# Altium schematic sheet board_pa98.SchDoc
size 840 x 594 mm; Scale: 1:1
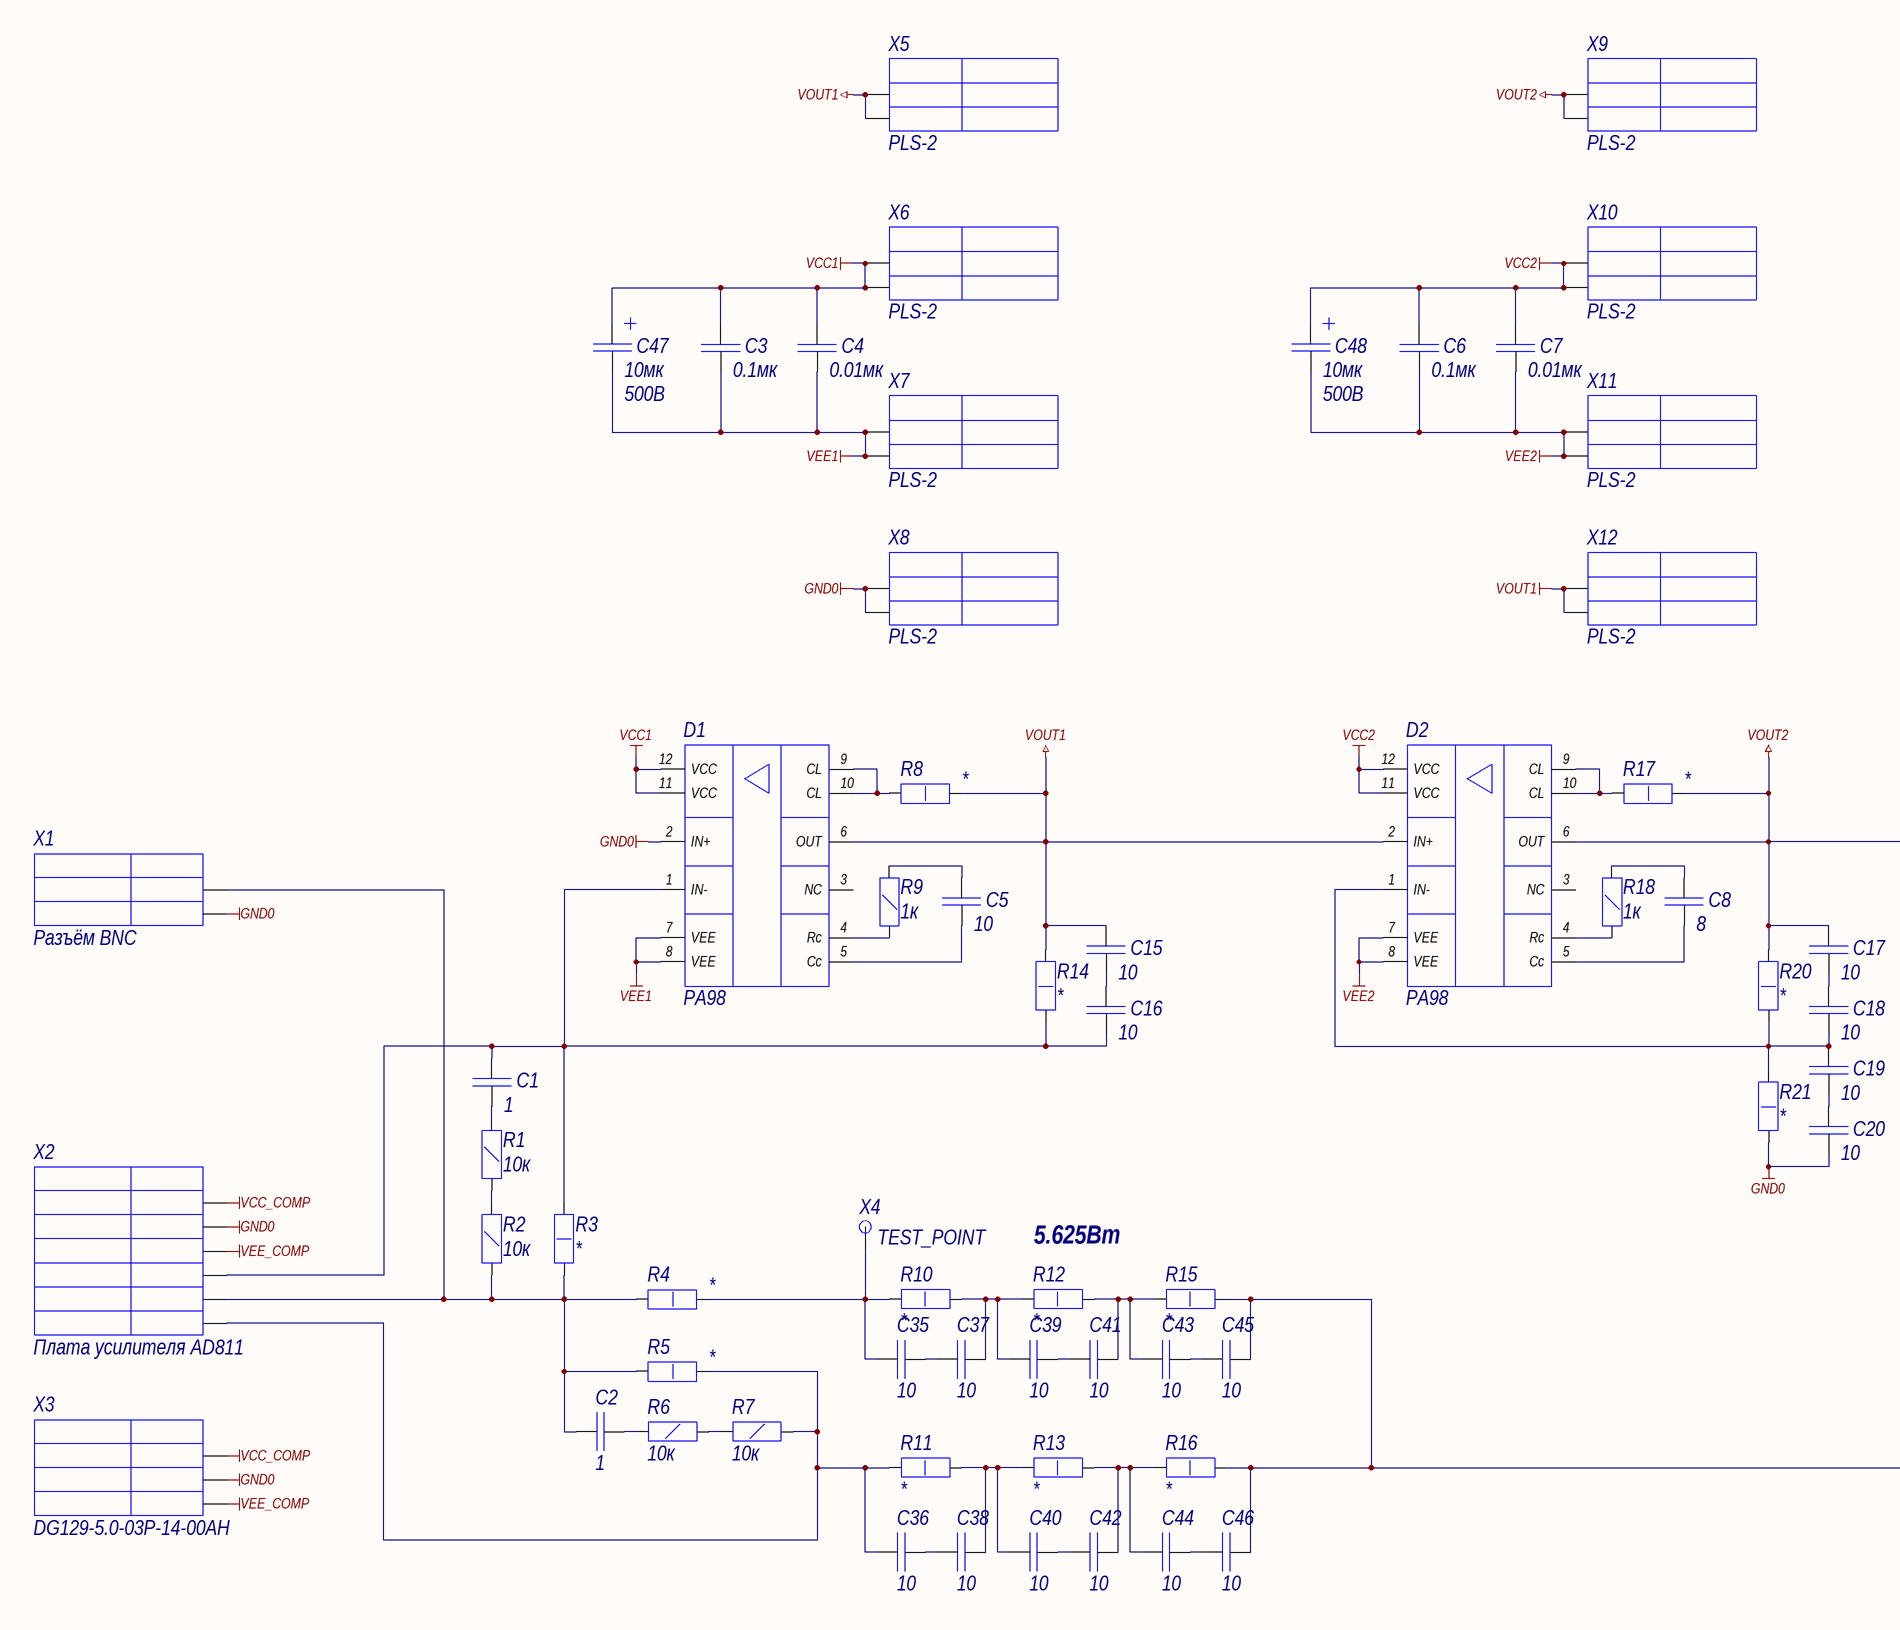
[diagram p0: board_pa98.SchDoc, left]
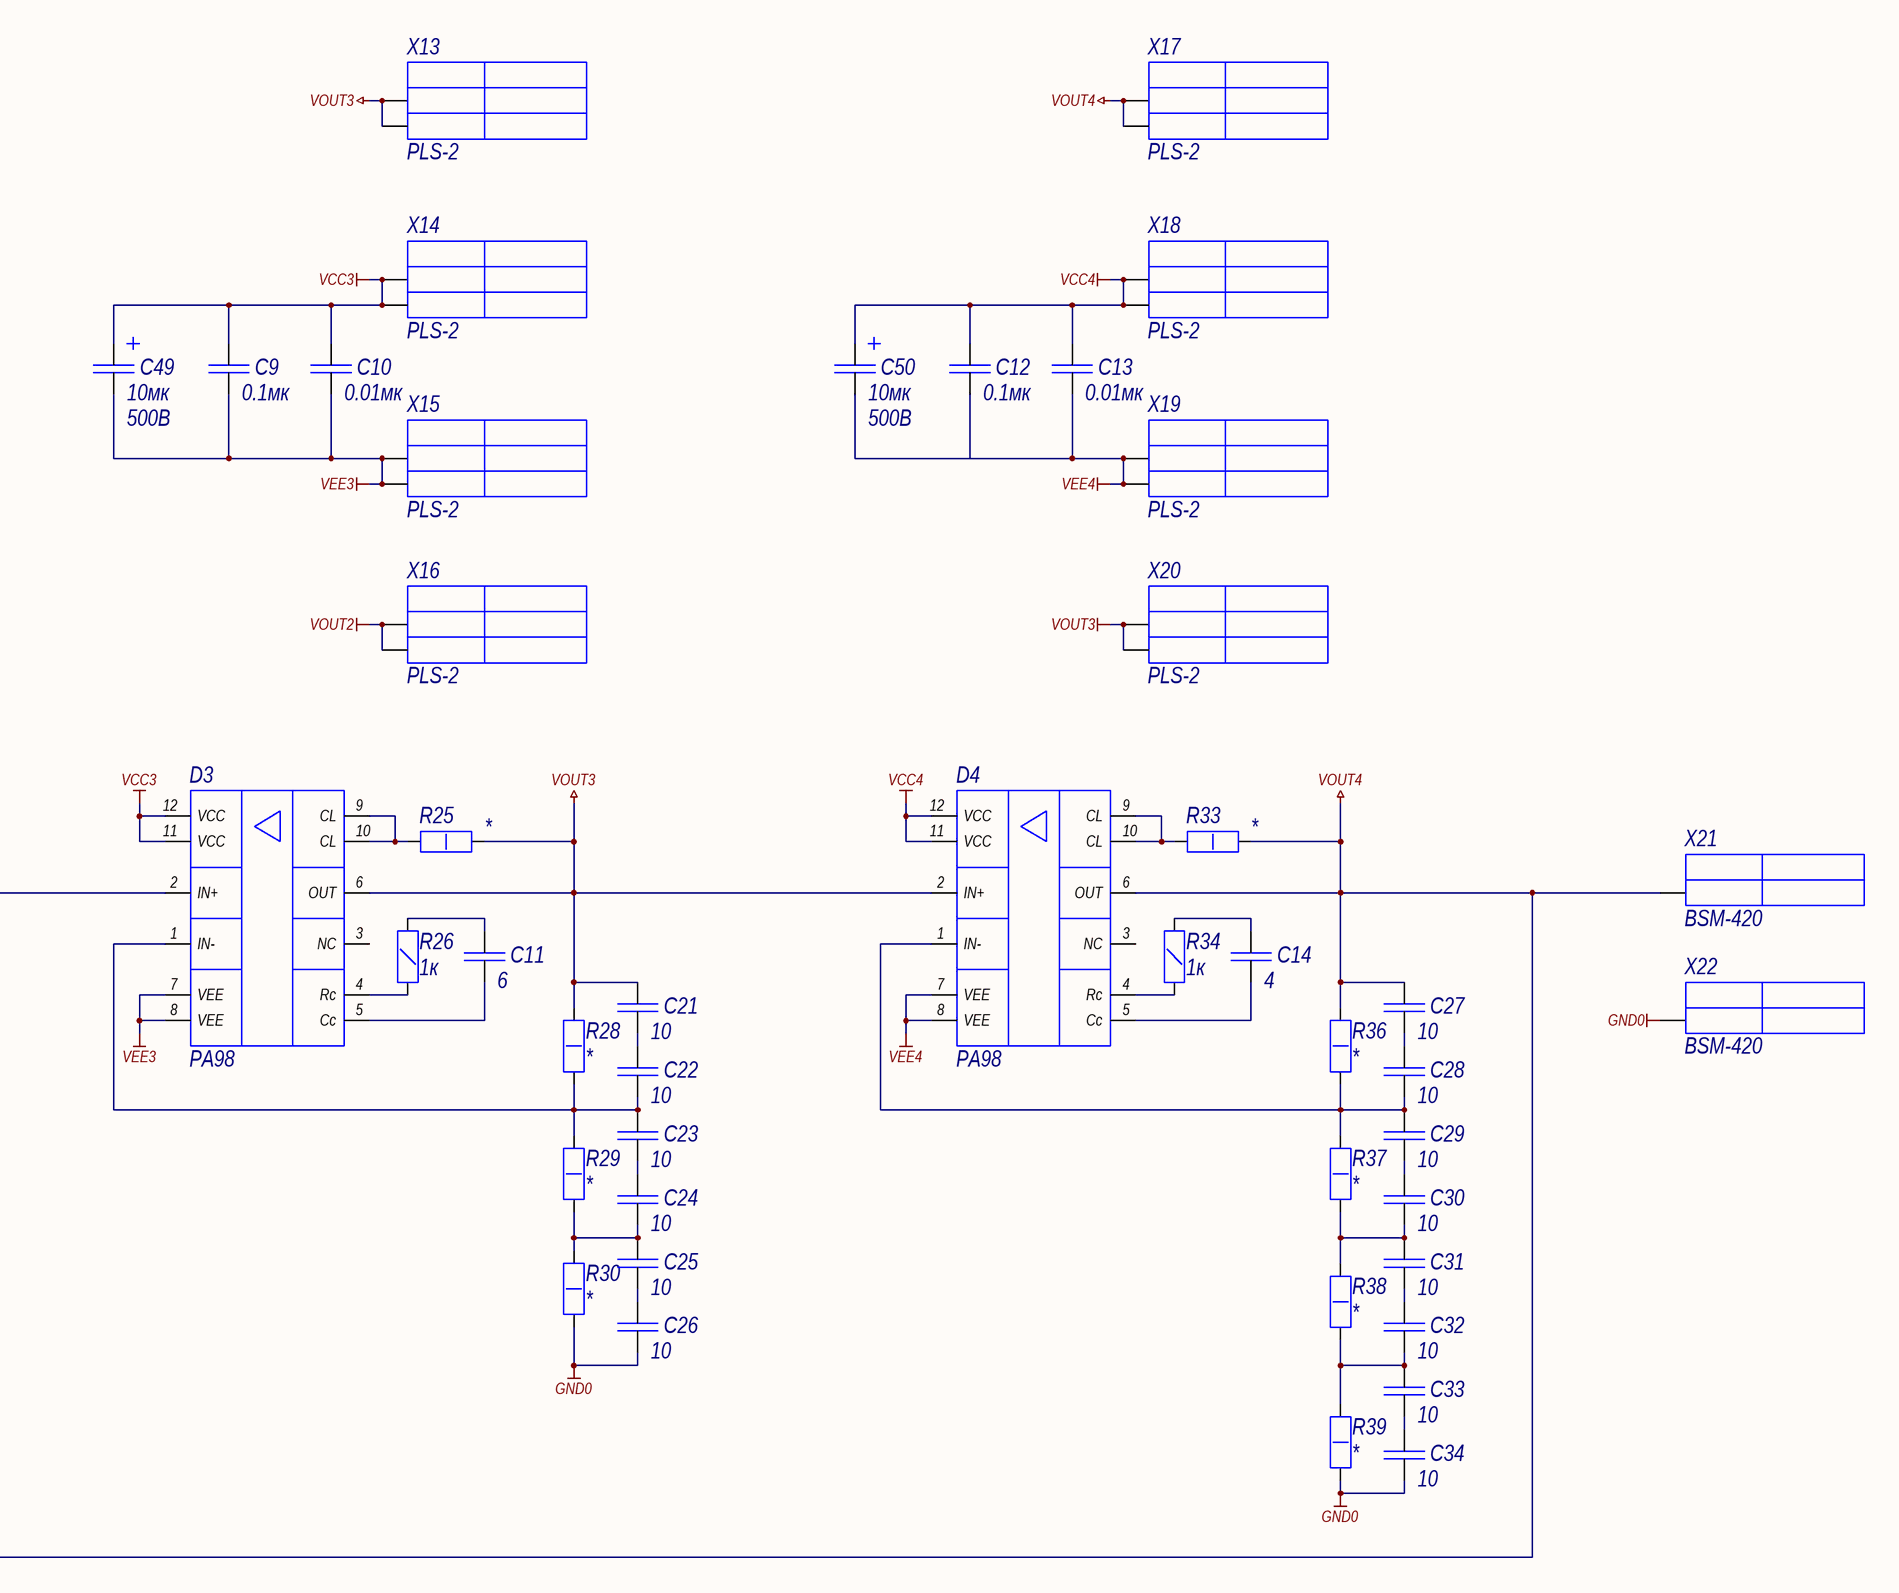
[diagram p1: board_pa98.SchDoc, right]

## Parts
C1  1  [C-1206]
C2  1  [C-1206]
C3  0.1мк  [C-1812]
C4  0.01мк  [C-1206]
C5  10  [C-1206]
C6  0.1мк  [C-1812]
C7  0.01мк  [C-1206]
C8  8  [C-1206]
C9  0.1мк  [C-1812]
C10  0.01мк  [C-1206]
C11  6  [C-1206]
C12  0.1мк  [C-1812]
C13  0.01мк  [C-1206]
C14  4  [C-1206]
C15  10  [C-1206]
C16  10  [C-1206]
C17  10  [C-1206]
C18  10  [C-1206]
C19  10  [C-1206]
C20  10  [C-1206]
C21  10  [C-1206]
C22  10  [C-1206]
C23  10  [C-1206]
C24  10  [C-1206]
C25  10  [C-1206]
C26  10  [C-1206]
C27  10  [C-1206]
C28  10  [C-1206]
C29  10  [C-1206]
C30  10  [C-1206]
C31  10  [C-1206]
C32  10  [C-1206]
C33  10  [C-1206]
C34  10  [C-1206]
C35  10  [C-1206]
C36  10  [C-1206]
C37  10  [C-1206]
C38  10  [C-1206]
C39  10  [C-1206]
C40  10  [C-1206]
C41  10  [C-1206]
C42  10  [C-1206]
C43  10  [C-1206]
C44  10  [C-1206]
C45  10  [C-1206]
C46  10  [C-1206]
C47  10мк  Voltage: 500В  [CAP: D13C5H25]
C48  10мк  Voltage: 500В  [CAP: D13C5H25]
C49  10мк  Voltage: 500В  [CAP: D13C5H25]
C50  10мк  Voltage: 500В  [CAP: D13C5H25]
D1  PA98  [PA-98]
D2  PA98  [PA-98]
D3  PA98  [PA-98]
D4  PA98  [PA-98]
R1  10к  [R-1206]
R2  10к  [R-1206]
R3  *  [R-2512]
R4  *  [R-2512]
R5  *  [R-2512]
R6  10к  [R-1206]
R7  10к  [R-1206]
R8  *  [R-2512]
R9  1к  [R-1206]
R10  *  [R-2512]
R11  *  [R-2512]
R12  *  [R-2512]
R13  *  [R-2512]
R14  *  [R-2512]
R15  *  [R-2512]
R16  *  [R-2512]
R17  *  [R-2512]
R18  1к  [R-1206]
R20  *  [R-2512]
R21  *  [R-2512]
R25  *  [R-2512]
R26  1к  [R-1206]
R28  *  [R-2512]
R29  *  [R-2512]
R30  *  [R-2512]
R33  *  [R-2512]
R34  1к  [R-1206]
R36  *  [R-2512]
R37  *  [R-2512]
R38  *  [R-2512]
R39  *  [R-2512]
X1  Разъём BNC  [BNC]
X2  Плата усилителя AD811  [BOARD_AD811]
X3  DG129-5.0-03P-14-00AH  [DG129-5.0-03P-14-00AH]
X4  TEST_POINT  [TEST_POINT]  (net tie, no BOM)
X5  PLS-2  [PLS-2]
X6  PLS-2  [PLS-2]
X7  PLS-2  [PLS-2]
X8  PLS-2  [PLS-2]
X9  PLS-2  [PLS-2]
X10  PLS-2  [PLS-2]
X11  PLS-2  [PLS-2]
X12  PLS-2  [PLS-2]
X13  PLS-2  [PLS-2]
X14  PLS-2  [PLS-2]
X15  PLS-2  [PLS-2]
X16  PLS-2  [PLS-2]
X17  PLS-2  [PLS-2]
X18  PLS-2  [PLS-2]
X19  PLS-2  [PLS-2]
X20  PLS-2  [PLS-2]
X21  BSM-420  [BSM-420-R]
X22  BSM-420  [BSM-420-B]

## Nets
GND0: C20.2 C26.2 C34.2 D1.2(IN+) R21.1 R30.1 R39.1 X1.2 X2.2 X3.2 X8.1 X8.2 X22.1
VCC1: C3.2 C4.2 C47.1 D1.11(VCC) D1.12(VCC) X6.1 X6.2
VCC2: C6.2 C7.2 C48.1 D2.11(VCC) D2.12(VCC) X10.1 X10.2
VCC3: C9.2 C10.2 C49.1 D3.11(VCC) D3.12(VCC) X14.1 X14.2
VCC4: C12.2 C13.2 C50.1 D4.11(VCC) D4.12(VCC) X18.1 X18.2
VCC_COMP: X2.1 X3.1
VEE1: C3.1 C4.1 C47.2 D1.7(VEE) D1.8(VEE) X7.1 X7.2
VEE2: C6.1 C7.1 C48.2 D2.7(VEE) D2.8(VEE) X11.1 X11.2
VEE3: C9.1 C10.1 C49.2 D3.7(VEE) D3.8(VEE) X15.1 X15.2
VEE4: C12.1 C13.1 C50.2 D4.7(VEE) D4.8(VEE) X19.1 X19.2
VEE_COMP: X2.3 X3.3
VOUT1: C15.1 D1.6(OUT) D2.2(IN+) R8.2 R14.2 X5.1 X5.2 X12.1 X12.2
VOUT2: C17.1 D2.6(OUT) D3.2(IN+) R17.2 R20.2 X9.1 X9.2 X16.1 X16.2
VOUT3: C21.1 D3.6(OUT) D4.2(IN+) R25.2 R28.2 X13.1 X13.2 X20.1 X20.2
VOUT4: C27.1 C45.1 C46.1 D4.6(OUT) R15.1 R16.1 R33.2 R36.2 X17.1 X17.2 X21.1
NetC1_1: C1.1 C16.2 D1.1(IN-) R3.2 R14.1 X2.4
NetC1_2: C1.2 R1.2
NetC2_1: C2.1 R2.1 R3.1 R4.1 R5.1 X1.1 X2.5
NetC2_2: C2.2 R6.2
NetC5_1: C5.1 R9.1
NetC5_2: C5.2 D1.5(Cc)
NetC8_1: C8.1 R18.1
NetC8_2: C8.2 D2.5(Cc)
NetC11_1: C11.1 R26.1
NetC11_2: C11.2 D3.5(Cc)
NetC14_1: C14.1 R34.1
NetC14_2: C14.2 D4.5(Cc)
NetC15_2: C15.2 C16.1
NetC17_2: C17.2 C18.1
NetC18_2: C18.2 C19.1 D2.1(IN-) R20.1 R21.2
NetC19_2: C19.2 C20.1
NetC21_2: C21.2 C22.1
NetC22_2: C22.2 C23.1 D3.1(IN-) R28.1 R29.2
NetC23_2: C23.2 C24.1
NetC24_2: C24.2 C25.1 R29.1 R30.2
NetC25_2: C25.2 C26.1
NetC27_2: C27.2 C28.1
NetC28_2: C28.2 C29.1 D4.1(IN-) R36.1 R37.2
NetC29_2: C29.2 C30.1
NetC30_2: C30.2 C31.1 R37.1 R38.2
NetC31_2: C31.2 C32.1
NetC32_2: C32.2 C33.1 R38.1 R39.2
NetC33_2: C33.2 C34.1
NetC35_1: C35.1 C37.2
NetC35_2: C35.2 R4.2 R10.2 X4.1
NetC36_1: C36.1 C38.2
NetC36_2: C36.2 R5.2 R7.1 R11.2 X2.6
NetC37_1: C37.1 C39.2 R10.1 R12.2
NetC38_1: C38.1 C40.2 R11.1 R13.2
NetC39_1: C39.1 C41.2
NetC40_1: C40.1 C42.2
NetC41_1: C41.1 C43.2 R12.1 R15.2
NetC42_1: C42.1 C44.2 R13.1 R16.2
NetC43_1: C43.1 C45.2
NetC44_1: C44.1 C46.2
NetD1_4: D1.4(Rc) R9.2
NetD1_9: D1.9(CL) D1.10(CL) R8.1
NetD2_4: D2.4(Rc) R18.2
NetD2_9: D2.9(CL) D2.10(CL) R17.1
NetD3_4: D3.4(Rc) R26.2
NetD3_9: D3.9(CL) D3.10(CL) R25.1
NetD4_4: D4.4(Rc) R34.2
NetD4_9: D4.9(CL) D4.10(CL) R33.1
NetR1_1: R1.1 R2.2
NetR6_1: R6.1 R7.2

Not connected (* = marked no-connect by the designer): D1 3(NC); D2 3(NC); D3 3(NC); D4 3(NC)

## Notes on the sheet
- 5.625Вт
- Перв. примен.
- Справ. №
- Подп. и дата
- Инв. № дубл.
- Взам. инв. №
- Разраб.
- Изм.
- Лист
- № докум.
- Подп.
- Дата
- Лит.
- Масса
- Масштаб
- Пров.
- Т.контр.
- Листов
- Инв. № подл.
- Утв.
- Н.контр.
- Копировал
- Формат А1

## Library data of the parts
C1 C2 C5 C8 C11 C14-C46 = C1206: Voltage: 630В; Dielectric: NPO; ComponentDescription: =ComponentType+', '+Package+', '+Voltage+'В, '+Value+', '+Dielectric; ComponentType: Конденсатор керамический SMD; Package: C-1206
  C1 C2: Value: 1
  C5 C15-C46: Value: 10
  C8: Value: 8
  C11: Value: 6
  C14: Value: 4
C3 C6 C9 C12 = C1812: Voltage: 630; Dielectric: X7R; ComponentDescription: =ComponentType+', '+Package+', '+Voltage+'В, '+Value+', '+Dielectric; ComponentType: Конденсатор керамический SMD; Package: C-1812; Value: 0.1мк
C4 C7 C10 C13 = C1206: Voltage: 630; Dielectric: X7R; ComponentDescription: =ComponentType+', '+Package+', '+Voltage+'В, '+Value+', '+Dielectric; ComponentType: Конденсатор керамический SMD; Package: C-1206; Value: 0.01мк
C47-C50 = Aluminum electrolytic capacitor: Конденсатор электролитический; Type: ESR; ComponentDescription: =ComponentType+', '+Value+', '+Voltage+', '+Type+', '+Package; ComponentType: Конденсатор электролитический; Package: CAP: D13C5H25; Value: 10мк
D1-D4 = PA98: Микросхема  ОУ; ComponentDescription: =ComponentTypе+', '+Comment+', '+Package; ComponentTypе: Микросхема  ОУ; Package: PA-98
R1 R2 R6 R7 R9 R18 R26 R34 = R1206: Резистор SMD; Tolerance: 5%; ComponentDescription: =ComponentType+', '+ Package +', '+Value+'Ом, ' + Tolerance; ComponentType: Резистор SMD; Package: R-1206
  R1 R2 R6 R7: Value: 10к
  R9 R18 R26 R34: Value: 1к
R3-R5 R8 R10-R17 R20 R21 R25 R28-R30 R33 R36-R39 = R2512: Резистор SMD; Tolerance: 5%; ComponentDescription: =ComponentType+', '+ Package +', '+Value+'Ом, ' + Tolerance; ComponentType: Резистор SMD; Package: R-2512; Value: *
X1 = BNC: Разъём; PartNumber: 32K249-400L5; Design Note: Footprint in library is a generic example - only application specific footprint delivers High Performance; ComponentDescription: Разъём антенный, Разъём BNC; ComponentTypе: Разъём антенный; DatasheetVersion: b00; PackageVersion: b00; PackageReference: 32K249-400L5; PackageDescription: SMA Right Angle Jack, 14.8 x 6.35 x 9.7 mm; Mounting Technology: Through Hole; ComponentLink1Description: Manufacturer URL; ComponentLink1URL: http://www.rosenberger.de; ComponentLink2Description: Datasheet; ComponentLink2URL: http://rosenberger.de/ok/images/documents/db/32K249-400L5.pdf; ComponentLink3Description: Package Specification; ComponentLink3URL: http://rosenberger.de/ok/images/documents/db/32K249-400L5.pdf; ComponentLink4Description: Series Overview / Design Note; ComponentLink4URL: http://rosenberger.de/ok/images/documents/spez/32.pdf; ComponentLink5Description: Webshop / RFQ; ComponentLink5URL: http://www.rosenberger.com/en/contact/sales/
X2 = BOARD_AD811: ComponentDescription: Плата усилителя AD811
X3 = DG129-5.0-03P-14-00AH: Разъем винтовой; ComponentDescription: Разъем винтовой, DG129-5.0-03P-14-00AH; ComponentTypе: Разъем винтовой
X4 = TEST_POINT: Тестовый контакт
X5-X20 = PLS-2: Разъём штыревой; ComponentDescription: Разъём штыревой, PLS-2; ComponentTypе: Разъём штыревой
X21 X22 = BSM-420: Разъём; PartNumber: 32K249-400L5; Design Note: Footprint in library is a generic example - only application specific footprint delivers High Performance; ComponentDescription: Разъём антенный, BSM-420; ComponentTypе: Разъём антенный; DatasheetVersion: b00; PackageVersion: b00; PackageReference: 32K249-400L5; PackageDescription: SMA Right Angle Jack, 14.8 x 6.35 x 9.7 mm; Mounting Technology: Through Hole; ComponentLink1Description: Manufacturer URL; ComponentLink1URL: http://www.rosenberger.de; ComponentLink2Description: Datasheet; ComponentLink2URL: http://rosenberger.de/ok/images/documents/db/32K249-400L5.pdf; ComponentLink3Description: Package Specification; ComponentLink3URL: http://rosenberger.de/ok/images/documents/db/32K249-400L5.pdf; ComponentLink4Description: Series Overview / Design Note; ComponentLink4URL: http://rosenberger.de/ok/images/documents/spez/32.pdf; ComponentLink5Description: Webshop / RFQ; ComponentLink5URL: http://www.rosenberger.com/en/contact/sales/